# Altium schematic sheet Main.SchDoc
size A4; SheetNumber: 1; SheetTotal: 6
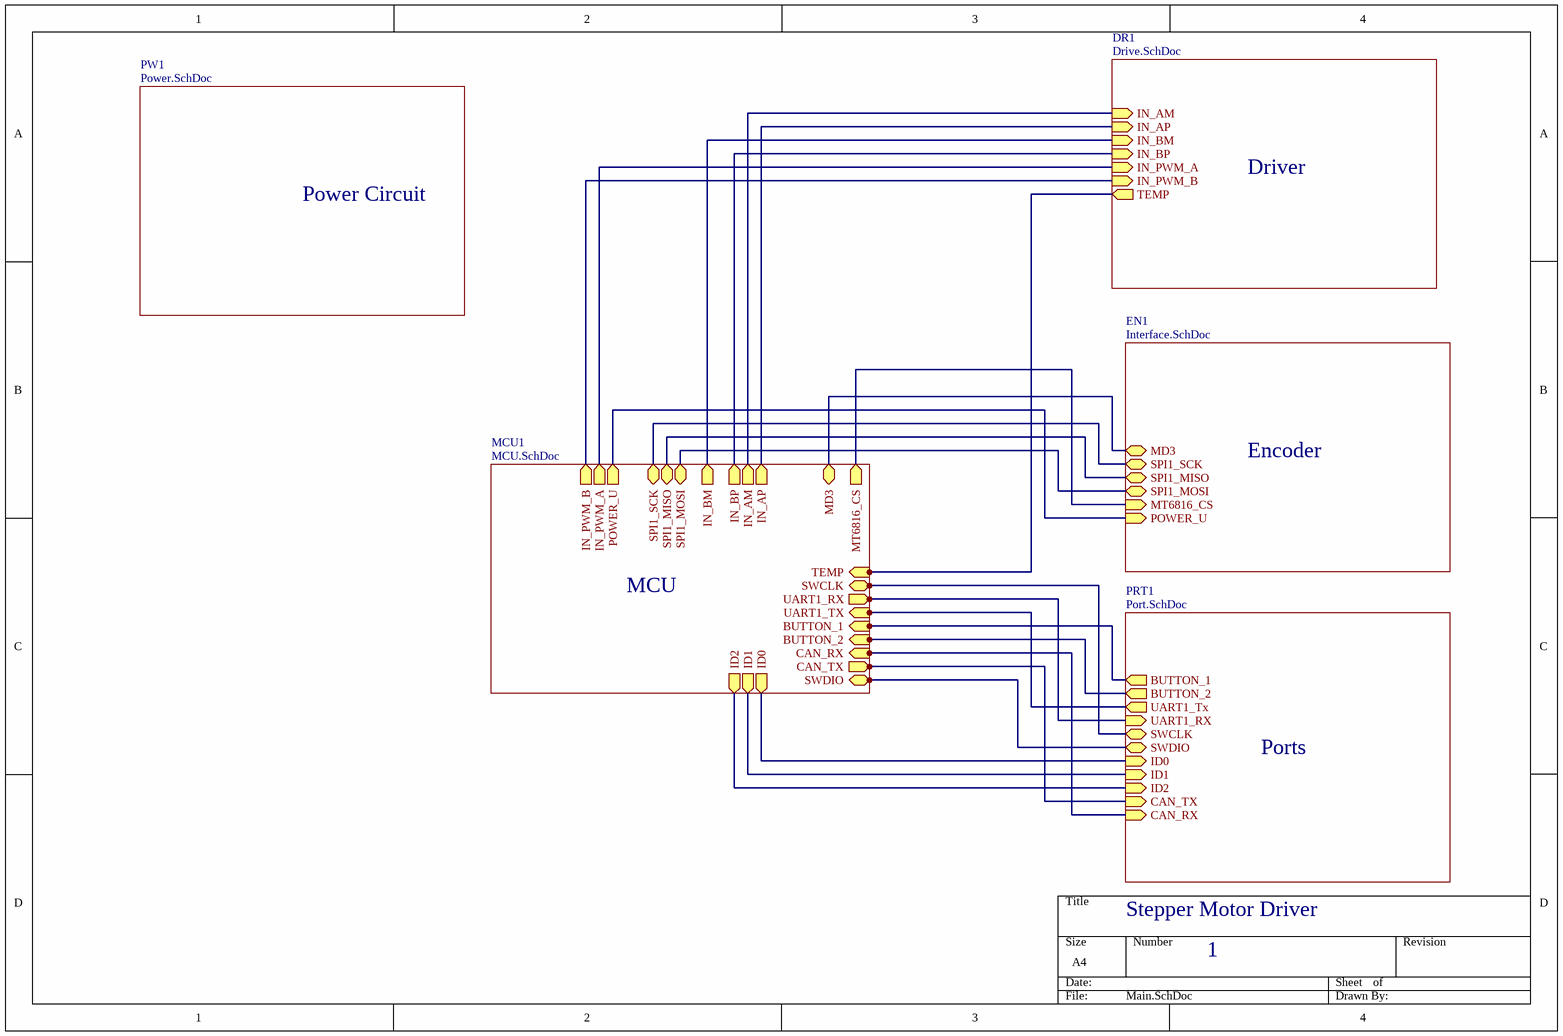
[diagram p0: Main.SchDoc]

## Sub-sheets
DR1 = Drive.SchDoc: IN_AM (in), IN_AP (in), IN_BM (in), IN_BP (in), IN_PWM_A (in), IN_PWM_B (in), TEMP (out)
EN1 = Interface.SchDoc: SPI1_SCK (bidir), SPI1_MISO (bidir), SPI1_MOSI (bidir), MT6816_CS (in), POWER_U (in), MD3 (bidir)
MCU1 = MCU.SchDoc: BUTTON_2 (in), SPI1_SCK (bidir), SPI1_MISO (bidir), SPI1_MOSI (bidir), UART1_TX (in), UART1_RX (out), CAN_RX (in), CAN_TX (out), IN_PWM_B (out), IN_PWM_A (out), BUTTON_1 (in), POWER_U (out), TEMP (in), IN_BM (out), IN_BP (out), IN_AM (out), IN_AP (out), ID0 (out), ID1 (out), ID2 (out), SWDIO (bidir), SWCLK (bidir), MT6816_CS (out), MD3 (bidir)
PRT1 = Port.SchDoc: BUTTON_1 (out), BUTTON_2 (out), UART1_Tx (out), UART1_RX (in), SWCLK (bidir), SWDIO (bidir), ID0 (in), ID1 (in), ID2 (in), CAN_TX (in), CAN_RX (in)
PW1 = Power.SchDoc: no entries

## Nets
(unnamed): sheet MCU1/BUTTON_2, sheet PRT1/BUTTON_2
(unnamed): sheet MCU1/SPI1_SCK, sheet EN1/SPI1_SCK
(unnamed): sheet MCU1/SPI1_MISO, sheet EN1/SPI1_MISO
(unnamed): sheet MCU1/SPI1_MOSI, sheet EN1/SPI1_MOSI
(unnamed): sheet MCU1/UART1_TX, sheet PRT1/UART1_Tx
(unnamed): sheet MCU1/UART1_RX, sheet PRT1/UART1_RX
(unnamed): sheet MCU1/CAN_RX, sheet PRT1/CAN_RX
(unnamed): sheet MCU1/CAN_TX, sheet PRT1/CAN_TX
(unnamed): sheet MCU1/IN_PWM_B, sheet DR1/IN_PWM_B
(unnamed): sheet MCU1/IN_PWM_A, sheet DR1/IN_PWM_A
(unnamed): sheet MCU1/BUTTON_1, sheet PRT1/BUTTON_1
(unnamed): sheet MCU1/POWER_U, sheet EN1/POWER_U
(unnamed): sheet MCU1/TEMP, sheet DR1/TEMP
(unnamed): sheet MCU1/IN_BM, sheet DR1/IN_BM
(unnamed): sheet MCU1/IN_BP, sheet DR1/IN_BP
(unnamed): sheet MCU1/IN_AM, sheet DR1/IN_AM
(unnamed): sheet MCU1/IN_AP, sheet DR1/IN_AP
(unnamed): sheet MCU1/ID0, sheet PRT1/ID0
(unnamed): sheet MCU1/ID1, sheet PRT1/ID1
(unnamed): sheet MCU1/ID2, sheet PRT1/ID2
(unnamed): sheet MCU1/SWDIO, sheet PRT1/SWDIO
(unnamed): sheet MCU1/SWCLK, sheet PRT1/SWCLK
(unnamed): sheet MCU1/MT6816_CS, sheet EN1/MT6816_CS
(unnamed): sheet MCU1/MD3, sheet EN1/MD3

## Notes on the sheet
- Driver
- Power Circuit
- Encoder
- MCU
- Ports
- Stepper Motor Driver
- 1